# Altium schematic sheet Coil Driver.SchDoc
size A; DocumentNumber: 3; SheetNumber: 3; SheetTotal: 4
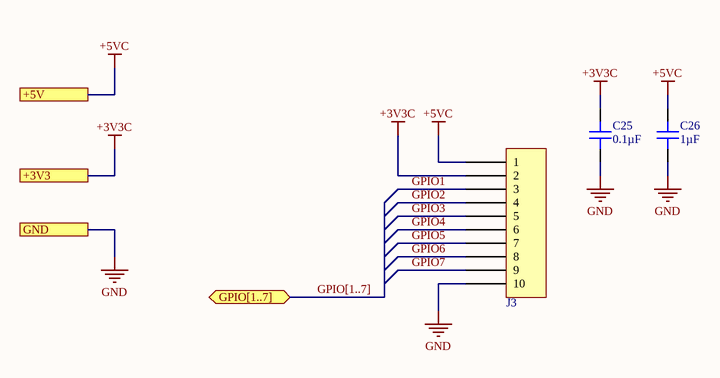
[diagram p0: Coil Driver.SchDoc]

## Parts
C25  0.1µF  [CAP 0402_1005]
C26  1µF  [CAP 0402_1005]
J3  0022272101  [MOLEX KK 0022272101]  (value not drawn)

## Ports
+3V3, +5V, GND, GPIO[1..7] (bidir)

## Nets
+3V3C: C25.2 J3.2 ; port +3V3
+5VC: C26.2 J3.1 ; port +5V
GND: C25.1 C26.1 J3.10 ; port GND
GPIO1: J3.3
GPIO2: J3.4
GPIO3: J3.5
GPIO4: J3.6
GPIO5: J3.7
GPIO6: J3.8
GPIO7: J3.9

## Buses and harness runs
bus GPIO[1..7] = port GPIO[1..7]

## Library data of the parts
C25 = 04023C104JAT2A: CAP CER 0.1UF 25V X7R 0402; Manufacturer: AVX Corporation; Tolerance: ±5%; Part Number: 04023C104JAT2A; Applications: General Purpose; Capacitance: 0.1µF; ComponentLink1Description: Datasheet; ComponentLink1URL: http://datasheets.avx.com/X7RDielectric.pdf; ComponentLink2Description: DigiKey Link; ComponentLink2URL: http://digikey.com/product-detail/en/avx-corporation/04023C104JAT2A/478-10050-1-ND/6564273; Device Package: 0402 (1005 Metric); LastUpdated: 2020-02-03 5:03:51 PM; Lifecycle Status: Active; Minimum Order: 1; Mounting Type: Surface Mount, MLCC; Operating Temperature: -55°C ~ 125°C; Package / Case: 0402 (1005 Metric); Packaging: CutTape; Part Status: Active; Price: 0.14; Series: -; Size / Dimension: 0.039" L x 0.020" W (1.00mm x 0.50mm); Supplier 1: DigiKey; Supplier Part Number 1: 478-10050-1-ND; Temperature Coefficient: X7R; Thickness (Max): 0.022" (0.56mm); Value: 0.1µF; Voltage - Rated: 25V
C26 = 0402BW105K160NGT: CAP CER 1UF 16V X5R 0402; Manufacturer: Knowles Novacap; Tolerance: ±10%; Part Number: 0402BW105K160NGT; Applications: General Purpose; Capacitance: 1µF; ComponentLink1Description: Datasheet; ComponentLink1URL: https://www.knowlescapacitors.com/getattachment/6c8d48ef-fc2b-4752-ae2c-ce6c208de0c4/High-Capacitance-Chip.aspx; ComponentLink2Description: DigiKey Link; ComponentLink2URL: http://digikey.com/product-detail/en/knowles-novacap/0402BW105K160NGT/1763-1163-1-ND/7304074; Device Package: 0402 (1005 Metric); Features: Gold Flash Termination; LastUpdated: 2020-02-03 5:04:03 PM; Lifecycle Status: Active; Minimum Order: 1; Mounting Type: Surface Mount, MLCC; Operating Temperature: -55°C ~ 85°C; Package / Case: 0402 (1005 Metric); Packaging: TapeAndReel; Part Status: Active; Price: 0.71; Series: -; Size / Dimension: 0.040" L x 0.020" W (1.02mm x 0.51mm); Supplier 1: DigiKey; Supplier Part Number 1: 1763-1163-1-ND; Temperature Coefficient: X5R; Thickness (Max): 0.024" (0.61mm); Value: 1µF; Voltage - Rated: 16V
J3 = 0022272101: CONN HEADER VERT 10POS 2.54MM; Manufacturer: Molex; Contact Length - Mating: 0.295" (7.49mm); Contact Length - Post: 0.140" (3.56mm); Material Flammability Rating: UL94 V-0; Number of Positions: 10; Number of Positions Loaded: All; Overall Contact Length: 0.560" (14.22mm); Pitch - Mating: 0.100" (2.54mm); Shrouding: Shrouded - 1 Wall; Style: Board to Cable/Wire; Part Number: 0022272101; ComponentLink1Description: Datasheet; ComponentLink1URL: https://www.molex.com/pdm_docs/sd/022272101_sd.pdf; ComponentLink2Description: DigiKey Link; ComponentLink2URL: http://digikey.com/product-detail/en/molex/0022272101/WM4119-ND/1130585; Connector Type: Header; Contact Finish - Mating: Tin; Contact Finish - Post: Tin; Contact Finish Thickness - Mating: 100.0µin (2.54µm); Contact Material: Brass; Contact Shape: Square; Contact Type: Male Pin; Fastening Type: Friction Lock; Insulation Color: Natural; Insulation Height: 0.461" (11.70mm); Insulation Material: Polyamide (PA), Nylon; LastUpdated: 2020-02-03 5:11:43 PM; Lifecycle Status: Active; Minimum Order: 1; Mounting Type: Through Hole; Number of Rows: 1; Packaging: Bulk; Part Status: Active; Price: 0.73; Series: KK 6410; Supplier 1: DigiKey; Supplier Part Number 1: WM4119-ND; Termination: Solder